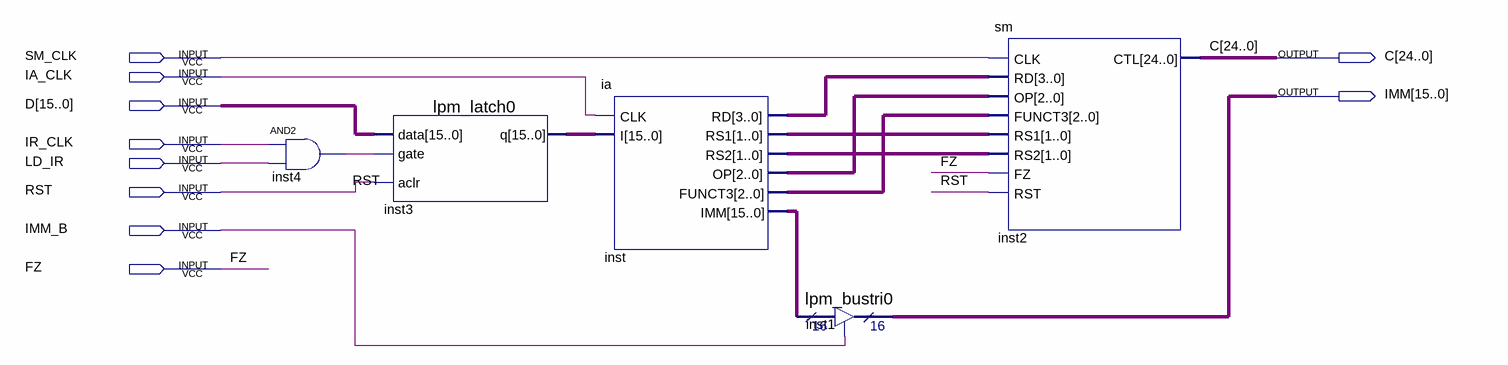
[diagram p0: schematic sheet]
// Quartus schematic ctl.bdf as structural Verilog: 5 symbols, 10 pins
module ctl (
  input  SM_CLK,
  input  IA_CLK,
  input  [15:0] D,
  input  IR_CLK,
  input  LD_IR,
  input  RST,
  input  IMM_B,
  input  FZ,
  output [24:0] C,
  output [15:0] IMM
);

  wire inst4_out;
  wire [1:0] inst_rs1, inst_rs2;
  wire [2:0] inst_funct3, inst_op;
  wire [3:0] inst_rd;
  wire [15:0] inst3_q, inst_imm;

  and inst4 (inst4_out, IR_CLK, LD_IR);
  lpm_latch0 inst3 (.data(D), .gate(inst4_out), .aclr(RST), .q(inst3_q));
  ia inst (
    .CLK(IA_CLK), .I(inst3_q), .RD(inst_rd), .RS1(inst_rs1), .RS2(inst_rs2), .OP(inst_op),
    .FUNCT3(inst_funct3), .IMM(inst_imm));
  lpm_bustri0 inst1 (.enabledt(IMM_B), .data(inst_imm), .tridata(IMM));
  sm inst2 (
    .CLK(SM_CLK), .RD(inst_rd), .OP(inst_op), .FUNCT3(inst_funct3), .RS1(inst_rs1), .RS2(inst_rs2), .FZ(FZ),
    .RST(RST), .CTL(C));
endmodule
